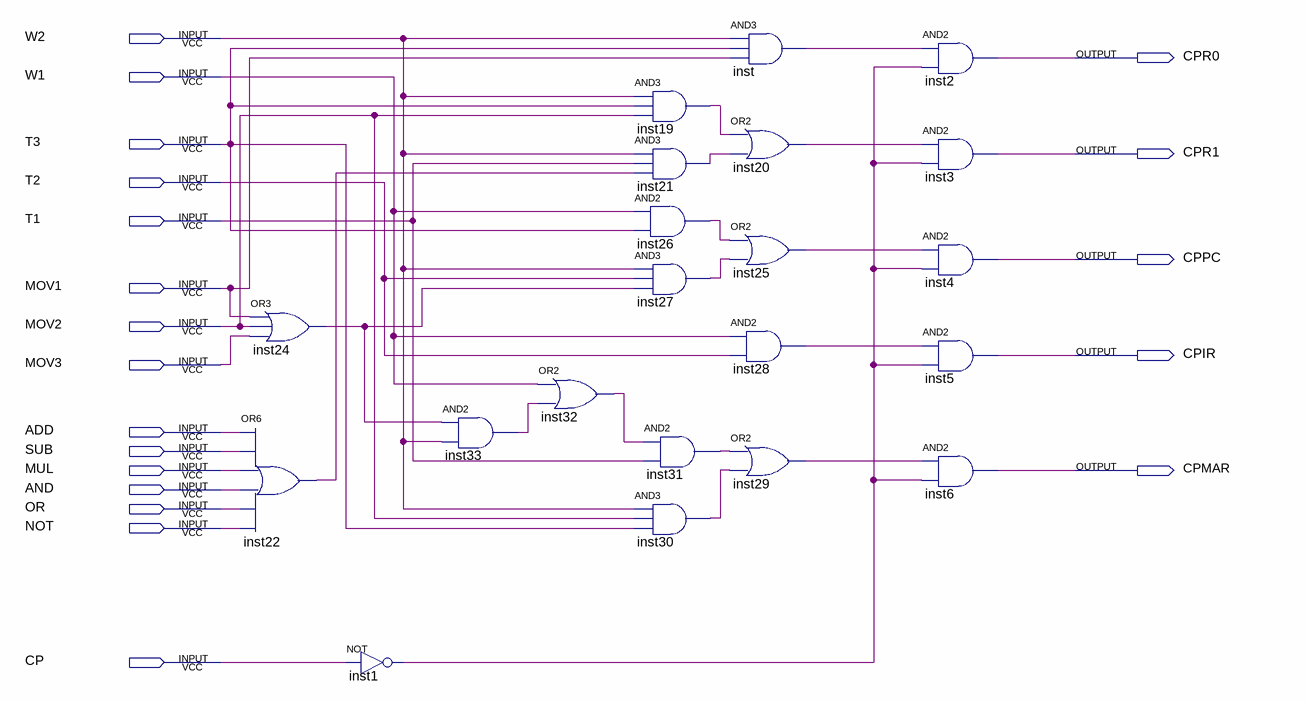
[diagram p0: schematic sheet]
// Quartus schematic CP.bdf as structural Verilog: 21 symbols, 20 pins
module CP (
  input  W2,
  input  W1,
  input  T3,
  input  T2,
  input  T1,
  input  MOV1,
  input  MOV2,
  input  MOV3,
  input  ADD,
  input  SUB,
  input  MUL,
  input  AND,
  input  OR,
  input  NOT,
  input  CP,
  output CPR0,
  output CPR1,
  output CPPC,
  output CPIR,
  output CPMAR
);

  wire inst1_out, inst19_out, inst20_out, inst21_out, inst22_out, inst24_out, inst25_out, inst26_out,
       inst27_out, inst28_out, inst29_out, inst30_out, inst31_out, inst32_out, inst33_out, inst_out;

  or inst24 (inst24_out, MOV1, MOV2, MOV3);
  or inst22 (inst22_out, ADD, SUB, MUL, AND, OR, NOT);
  not inst1 (inst1_out, CP);
  and inst33 (inst33_out, inst24_out, W2);
  or inst32 (inst32_out, W1, inst33_out);
  and inst19 (inst19_out, W2, T3, MOV2);
  and inst21 (inst21_out, W2, T1, inst22_out);
  and inst26 (inst26_out, W1, T3);
  and inst27 (inst27_out, W2, T2, inst24_out);
  and inst31 (inst31_out, inst32_out, T1);
  and inst30 (inst30_out, W2, MOV2, T3);
  and inst (inst_out, W2, T3, MOV1);
  or inst20 (inst20_out, inst19_out, inst21_out);
  or inst25 (inst25_out, inst26_out, inst27_out);
  and inst28 (inst28_out, W1, T2);
  or inst29 (inst29_out, inst31_out, inst30_out);
  and inst2 (CPR0, inst_out, inst1_out);
  and inst3 (CPR1, inst20_out, inst1_out);
  and inst4 (CPPC, inst25_out, inst1_out);
  and inst5 (CPIR, inst28_out, inst1_out);
  and inst6 (CPMAR, inst29_out, inst1_out);
endmodule
